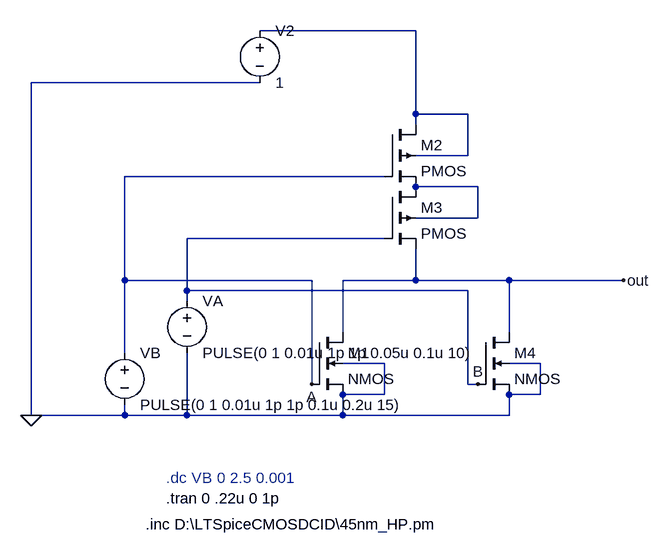
[diagram p0: schematic 45n_nor_gate.asc]
45n_nor_gate.asc, the LTspice schematic file:
Version 4
SHEET 1 1736 680
WIRE 1360 -512 1120 -512
WIRE 1120 -432 768 -432
WIRE 1360 -384 1360 -512
WIRE 1440 -384 1360 -384
WIRE 1360 -368 1360 -384
WIRE 1440 -320 1440 -384
WIRE 1440 -320 1360 -320
WIRE 1312 -288 912 -288
WIRE 1456 -272 1360 -272
WIRE 1456 -224 1456 -272
WIRE 1456 -224 1360 -224
WIRE 1312 -192 1008 -192
WIRE 912 -128 912 -288
WIRE 1200 -128 912 -128
WIRE 1360 -128 1360 -176
WIRE 1360 -128 1248 -128
WIRE 1504 -128 1360 -128
WIRE 1680 -128 1504 -128
WIRE 1008 -112 1008 -192
WIRE 1440 -112 1008 -112
WIRE 1008 -96 1008 -112
WIRE 1248 -48 1248 -128
WIRE 1504 -48 1504 -128
WIRE 912 -16 912 -128
WIRE 1312 0 1248 0
WIRE 1552 0 1504 0
WIRE 1200 32 1200 -128
WIRE 1440 32 1440 -112
WIRE 1456 32 1440 32
WIRE 1312 48 1312 0
WIRE 1312 48 1248 48
WIRE 1552 48 1552 0
WIRE 1552 48 1504 48
WIRE 768 80 768 -432
WIRE 912 80 912 64
WIRE 912 80 768 80
WIRE 1008 80 1008 -16
WIRE 1008 80 912 80
WIRE 1248 80 1248 48
WIRE 1248 80 1008 80
WIRE 1504 80 1504 48
WIRE 1504 80 1248 80
FLAG 1200 32 A
FLAG 1456 32 B
FLAG 1680 -128 out
FLAG 768 80 0
SYMBOL nmos4 1200 -48 R0
SYMATTR InstName M1
SYMATTR Value2 l=45n w=90n ad=.0.0081p as=.0.0081p pd=360n ps=360n
SYMBOL voltage 912 -32 R0
WINDOW 123 0 0 Left 0
WINDOW 39 0 0 Left 0
SYMATTR InstName VB
SYMATTR Value PULSE(0 1 0.01u 1p 1p 0.1u 0.2u 15)
SYMBOL voltage 1120 -528 R0
WINDOW 123 0 0 Left 0
WINDOW 39 0 0 Left 0
SYMATTR InstName V2
SYMATTR Value 1
SYMBOL cmosp 1312 -368 R0
SYMATTR InstName M2
SYMATTR Value2 l=45n w=90n ad=.0.0081p as=0.0081p pd=360n ps=360n
SYMATTR Value PMOS
SYMBOL cmosp 1312 -272 R0
SYMATTR InstName M3
SYMATTR Value2 l=45n w=90n ad=.0.0081p as=0.0081p pd=360n ps=360n
SYMATTR Value PMOS
SYMBOL nmos4 1456 -48 R0
SYMATTR InstName M4
SYMATTR Value2 l=45n w=90n ad=.0.0081p as=.0.0081p pd=360n ps=360n
SYMBOL voltage 1008 -112 R0
WINDOW 123 0 0 Left 0
WINDOW 39 0 0 Left 0
SYMATTR InstName VA
SYMATTR Value PULSE(0 1 0.01u 1p 1p 0.05u 0.1u 10)
TEXT 976 176 Left 2 ;.dc VB 0 2.5 0.001
TEXT 944 248 Left 2 !.inc D:\\LTSpiceCMOSDCID\\45nm_HP.pm
TEXT 976 208 Left 2 !.tran 0 .22u 0 1p

The netlist it stands for:
* 45n_nor_gate.asc
M1 out A 0 0 NMOS l=45n w=90n ad=.0.0081p as=.0.0081p pd=360n ps=360n
VB A 0 PULSE(0 1 0.01u 1p 1p 0.1u 0.2u 15)
V2 N001 0 1
M2 N001 A N002 N001 PMOS l=45n w=90n ad=.0.0081p as=0.0081p pd=360n ps=360n
M3 N002 B out N002 PMOS l=45n w=90n ad=.0.0081p as=0.0081p pd=360n ps=360n
M4 out B 0 0 NMOS l=45n w=90n ad=.0.0081p as=.0.0081p pd=360n ps=360n
VA B 0 PULSE(0 1 0.01u 1p 1p 0.05u 0.1u 10)
.model NMOS NMOS
.model PMOS PMOS
.lib standard.mos
* .dc VB 0 2.5 0.001
.inc D:\LTSpiceCMOSDCID\45nm_HP.pm
.tran 0 .22u 0 1p
.backanno
.end